# Altium schematic sheet RPM Inputs.SchDoc
size Letter; DocumentNumber: D_18; SheetNumber: 18; SheetTotal: 21
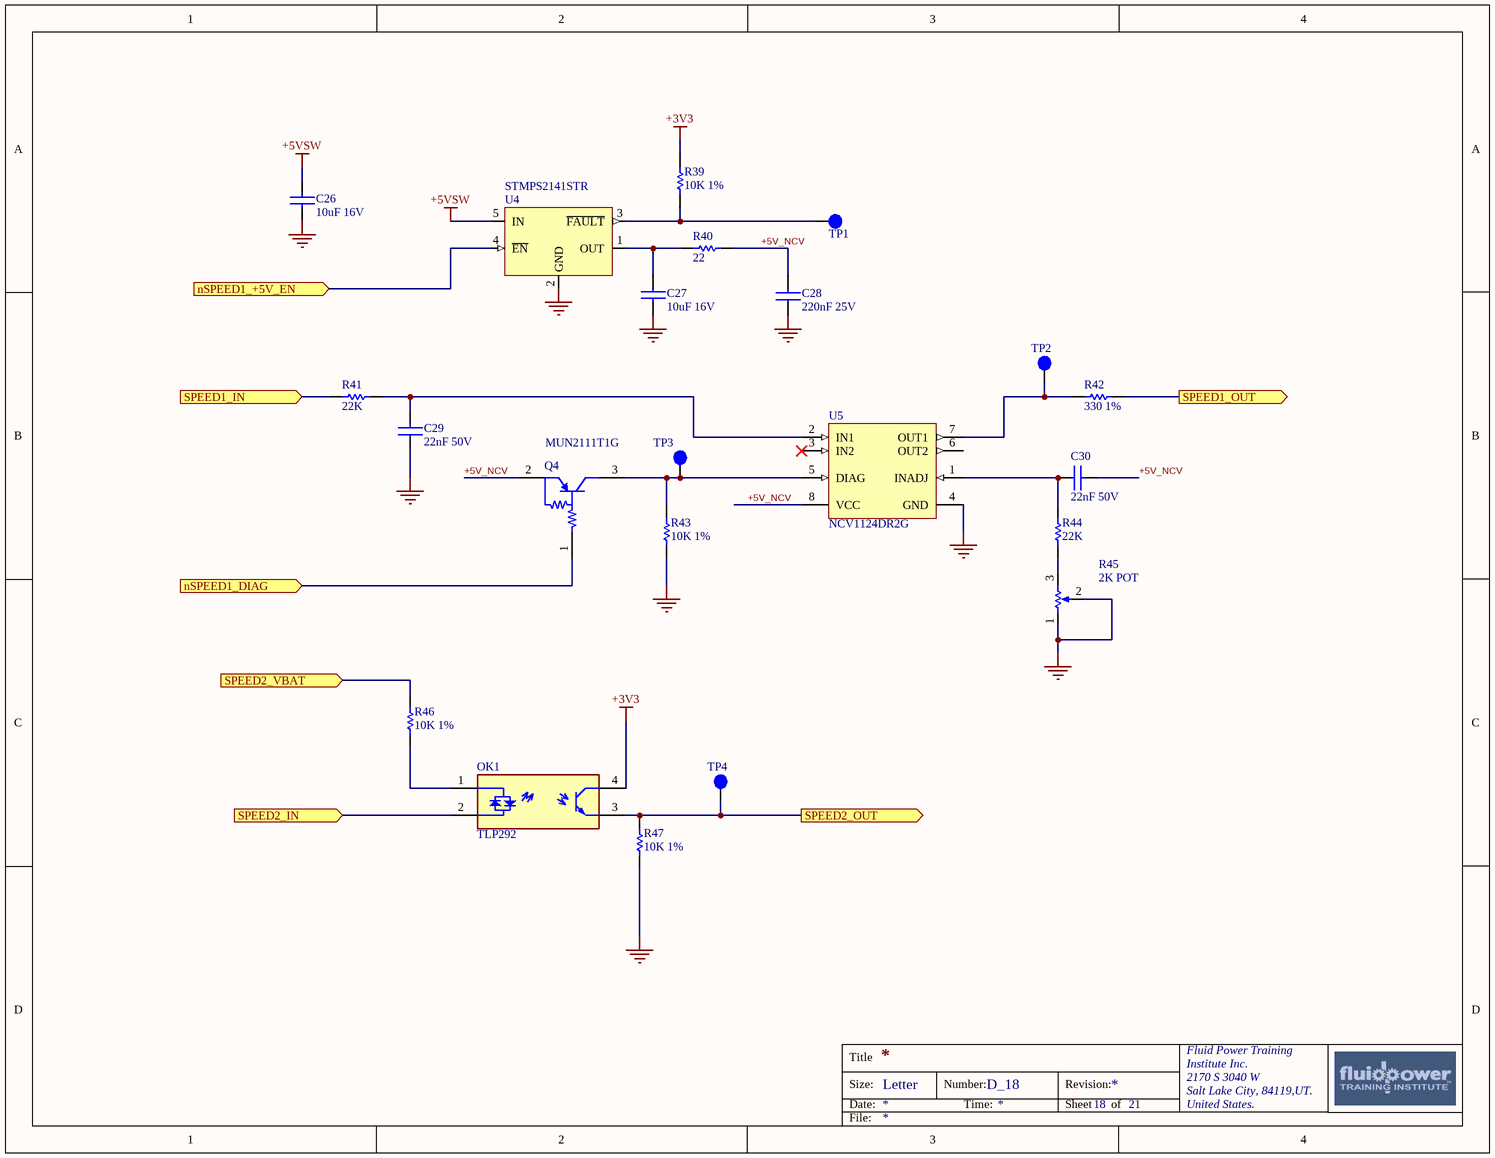
[diagram p0: RPM Inputs.SchDoc]

## Parts
C26  10uF 16V  [C0805]
C27  10uF 16V  [C0805]
C28  220nF 25V  [C0805]
C29  22nF 50V  [C0805]
C30  22nF 50V  [C0805]
OK1  TLP292  [SOIC127P700X220-4N]
Q4  MUN2111T1G  [ONSC-SC-59-3-318D-04_V]
R39  10K 1%  [R0805]
R40  22  [R0805]
R41  22K  [R0805]
R42  330 1%  [R0805]
R43  10K 1%  [R0805]
R44  22K  [R0805]
R45  2K POT  [TC33X]
R46  10K 1%  [R0805]
R47  10K 1%  [R0805]
TP1  T  [TESTPOINTSMD_1x1MM]  (value not drawn)  (no BOM)
TP2  T  [TESTPOINTSMD_1x1MM]  (value not drawn)  (no BOM)
TP3  T  [TESTPOINTSMD_1x1MM]  (value not drawn)  (no BOM)
TP4  T  [TESTPOINTSMD_1x1MM]  (value not drawn)  (no BOM)
U4  STMPS2141STR  [SOT95P280X145-5M]
U5  NCV1124DR2G  [ONSC-SOIC-8NB-8-751-07_V]

## Ports
nSPEED1_+5V_EN (in), nSPEED1_DIAG (in), SPEED1_IN (in), SPEED1_OUT (out), SPEED2_IN (in), SPEED2_OUT (out), SPEED2_VBAT (in)

## Nets
+3V3: OK1.4(COLLECTOR) R39.2
+5VSW: C26.1 U4.5(IN)
GND: C26.2 C27.2 C28.1 C29.1 R43.1 R45.1 R45.2 R47.1 U4.2(GND) U5.4(GND)
+5V_NCV: C28.2 C30.2 Q4.2(E) R40.2 U5.8(VCC)
nSPEED1_+5V_EN: U4.4(~{EN}) ; port nSPEED1_+5V_EN
nSPEED1_DIAG: Q4.1(B) ; port nSPEED1_DIAG
SPEED1_IN: R41.1 ; port SPEED1_IN
SPEED1_OUT: R42.2 ; port SPEED1_OUT
SPEED2_IN: OK1.2(A,C) ; port SPEED2_IN
SPEED2_OUT: OK1.3(EMITTER) R47.2 TP4.1 ; port SPEED2_OUT
SPEED2_VBAT: R46.2 ; port SPEED2_VBAT
NetC27_1: C27.1 R40.1 U4.1(OUT)
NetC29_2: C29.2 R41.2 U5.2(IN1)
NetC30_1: C30.1 R44.2 U5.1(INADJ)
NetOK1_1: OK1.1(C,A) R46.1
NetQ4_3: Q4.3(C) R43.2 TP3.1 U5.5(DIAG)
NetR39_1: R39.1 TP1.1 U4.3(~{FAULT})
NetR42_1: R42.1 TP2.1 U5.7(OUT1)
NetR44_1: R44.1 R45.3

Not connected (* = marked no-connect by the designer): U5 3(IN2)* 6(OUT2)

## Notes on the sheet
- Title
- Size:
- Date:
- Letter
- Number:
- Time:
- Revision:
- Sheet
- of
- Fluid Power Training
- Institute Inc.
- 2170 S 3040 W
- Salt Lake City, 84119,UT.
- United States.
- File:

## Library data of the parts
C26 C27 = GRM21BR61C106KE15L: CAP CER 10UF 16V X5R 0805; Manufacturer: Murata; Material: Ceramic; Tolerance: 10%; Supplier 1: Mouser; Supplier Part Number 1: 81-GRM21BR61C106KE15; Manufacturer Part Number: GRM21BR61C106KE15L; RoHS: Yes; Category: Ceramic Capacitors; Stock 1: 796080; Pricing 1: 1=0.31000, 10=0.21500, 100=0.12000, 500=0.08600, 1000=0.07500, 3000=0.06200 (USD); Mount: Surface Mount; Case/Package: 0805; Case Code (Imperial): 0805; Case Code (Metric): 2012; Min Operating Temperature: -55°C; Max Operating Temperature: 85°C; Packaging: Tape and Reel; Capacitance: 10uF; Voltage Rating: 16V; Package Quantity: 1; Voltage Rating (DC): 16V; Termination: SMD/SMT; Voltage: 16V; Dielectric: X5R; Length: 2mm; Height: 1.25mm; Width: 1.25mm; Depth: 1.25mm; Thickness: 0.053inch; Radiation Hardening: No; REACH SVHC: No SVHC; Lead Free: Lead Free; ComponentLink1URL: https://datasheet.ciiva.com/2989/product-2989696.pdf?src-supplier=Avnet; ComponentLink1Description: https://datasheet.ciiva.com/2989/product-2989696.pdf?src-supplier=Avnet; ComponentLink2URL: https://datasheet.ciiva.com/3777/1956grm21br61c106ke1523-3777137.pdf?src-supplier=Arrow; ComponentLink2Description: https://datasheet.ciiva.com/3777/1956grm21br61c106ke1523-3777137.pdf?src-supplier=Arrow; ComponentLink3URL: https://datasheet.ciiva.com/7719/1747468-7719090.pdf?src-supplier=Element14; ComponentLink3Description: https://datasheet.ciiva.com/7719/1747468-7719090.pdf?src-supplier=Element14; ComponentLink4URL: https://datasheet.ciiva.com/23628/460993-23628598.pdf?src-supplier=Newark; ComponentLink4Description: https://datasheet.ciiva.com/23628/460993-23628598.pdf?src-supplier=Newark; ComponentLink5URL: https://datasheet.ciiva.com/29202/450891-da-01-de-vs-chip-kond-0805-10-0-uf-10pr-16-0v-x5r-29202696.pdf?src-supplier=Conrad; ComponentLink5Description: https://datasheet.ciiva.com/29202/450891-da-01-de-vs-chip-kond-0805-10-0-uf-10pr-16-0v-x5r-29202696.pdf?src-supplier=Conrad; ComponentLink6URL: https://datasheet.ciiva.com/29199/454607-da-01-en-vs-kondensator-0805-29199611.pdf?src-supplier=Conrad; ComponentLink6Description: https://datasheet.ciiva.com/29199/454607-da-01-en-vs-kondensator-0805-29199611.pdf?src-supplier=Conrad; ComponentLink7URL: https://datasheet.ciiva.com/2989/product-2989697.pdf?src-supplier=Avnet; ComponentLink7Description: https://datasheet.ciiva.com/2989/product-2989697.pdf?src-supplier=Avnet; ComponentLink8URL: https://datasheet.ciiva.com/137/partnumbering-e-01-137917.pdf?src-supplier=Digi-Key; ComponentLink8Description: https://datasheet.ciiva.com/137/partnumbering-e-01-137917.pdf?src-supplier=Digi-Key; ComponentLink9URL: https://datasheet.ciiva.com/137/partnumbering-e-01-137918.pdf?src-supplier=Digi-Key; ComponentLink9Description: https://datasheet.ciiva.com/137/partnumbering-e-01-137918.pdf?src-supplier=Digi-Key; ComponentLink10URL: https://datasheet.ciiva.com/137/partnumbering-e-01-137919.pdf?src-supplier=Digi-Key; ComponentLink10Description: https://datasheet.ciiva.com/137/partnumbering-e-01-137919.pdf?src-supplier=Digi-Key
C28 = 08053C224JAT2A: AVX - 08053C224JAT2A - SMD Multilayer Ceramic Capacitor, 0.22 UF, 5%, X7R, 25 V, 0805 [2012 Metric] RoHS Compliant: Yes; Manufacturer: Kyocera AVX; Supplier 1: Mouser; Supplier Part Number 1: 581-08053C224JAT2A; Manufacturer Part Number: 08053C224JAT2A; RoHS: Yes; Category: Ceramic Capacitors; Stock 1: 712; Pricing 1: 1=0.28000, 10=0.19000, 100=0.09600, 500=0.09400, 1000=0.09400, 2000=0.09400 (USD); Mount: Surface Mount,PCB; Case/Package: 0805; Number of Pins: 2; Case Code (Imperial): 0805; Case Code (Metric): 2012; Dielectric Material: Ceramic; Contact Plating: Tin,Matte; Min Operating Temperature: -55°C; Max Operating Temperature: 125°C; Capacitance: 220nF; Tolerance: 5%; Packaging: Tape and Reel; Dielectric: X7R; Voltage Rating: 25V; Voltage Rating (DC): 25V; Termination: SMD/SMT; Package Quantity: 1; Voltage: 25V; Length: 2.01mm; Height: 1.4mm; Width: 1.25mm; Depth: 1.25mm; Thickness: 0.055inch; Radiation Hardening: No; REACH SVHC: No SVHC; Lead Free: Lead Free; ComponentLink1URL: https://datasheet.ciiva.com/5417/cx7r-218113-5417493.pdf?src-supplier=Mouser; ComponentLink1Description: https://datasheet.ciiva.com/5417/cx7r-218113-5417493.pdf?src-supplier=Mouser; ComponentLink2URL: https://datasheet.ciiva.com/16326/cx7r-16326599.pdf?src-supplier=Future+Electronics; ComponentLink2Description: https://datasheet.ciiva.com/16326/cx7r-16326599.pdf?src-supplier=Future+Electronics; ComponentLink3URL: https://datasheet.ciiva.com/162/cx7r-162344.pdf?src-supplier=Digi-Key; ComponentLink3Description: https://datasheet.ciiva.com/162/cx7r-162344.pdf?src-supplier=Digi-Key; ComponentLink4URL: https://datasheet.ciiva.com/162/cx7r-162345.pdf?src-supplier=Digi-Key; ComponentLink4Description: https://datasheet.ciiva.com/162/cx7r-162345.pdf?src-supplier=Digi-Key; ComponentLink5URL: https://datasheet.ciiva.com/162/cx7r-162346.pdf?src-supplier=Digi-Key; ComponentLink5Description: https://datasheet.ciiva.com/162/cx7r-162346.pdf?src-supplier=Digi-Key; ComponentLink6URL: https://datasheet.ciiva.com/17494/cx7r-17494874.pdf?src-supplier=Avnet+Europe; ComponentLink6Description: https://datasheet.ciiva.com/17494/cx7r-17494874.pdf?src-supplier=Avnet+Europe; ComponentLink7URL: https://datasheet.ciiva.com/14594/70001075-14594669.pdf?src-supplier=Allied+Electronics; ComponentLink7Description: https://datasheet.ciiva.com/14594/70001075-14594669.pdf?src-supplier=Allied+Electronics; ComponentLink8URL: https://datasheet.ciiva.com/7811/cx7r-7811999.pdf?src-supplier=Element14; ComponentLink8Description: https://datasheet.ciiva.com/7811/cx7r-7811999.pdf?src-supplier=Element14
C29 C30 = C0805C223K5RAC: KEMET 22nF Multilayer Ceramic Capacitor (MLCC) 50V dc 10% X7R dielectric max op. temp. 125C; Dissipation Factor: 2.5%; Supplier 1: Mouser; Supplier Part Number 1: 80-C0805C223K5RAC; Manufacturer: KEMET; Manufacturer Part Number: C0805C223K5RAC; RoHS: Yes; Category: Ceramic Capacitors; Stock 1: 100569; Pricing 1: 1=0.10000, 10=0.04800, 100=0.02400, 500=0.01900, 1000=0.01500, 4000=0.01000 (USD); Mount: Surface Mount; Case/Package: 0805; Dielectric Material: Ceramic; Case Code (Imperial): 0805; Case Code (Metric): 2012; Min Operating Temperature: -55°C; Max Operating Temperature: 125°C; Tolerance: 10%; Capacitance: 22nF; Dielectric: X7R; Packaging: Tape and Reel; Voltage Rating (DC): 50V; Termination: SMD/SMT; Package Quantity: 4000; Voltage Rating: 50V; Voltage: 50V; Length: 2mm; Height: 0.78mm; Depth: 1.25mm; Width: 1.2mm; Lead Pitch: 0.75mm; ComponentLink1URL: https://datasheet.ciiva.com/13384/kem-c1002-x7r-smd-357932-13384791.pdf?src-supplier=Mouser; ComponentLink1Description: https://datasheet.ciiva.com/13384/kem-c1002-x7r-smd-357932-13384791.pdf?src-supplier=Mouser; ComponentLink2URL: https://datasheet.ciiva.com/14116/slceramic-chip-condensers-e-14116587.pdf?src-supplier=Distrelec; ComponentLink2Description: https://datasheet.ciiva.com/14116/slceramic-chip-condensers-e-14116587.pdf?src-supplier=Distrelec
OK1 = TLP292(GB-TPL,E: OPTOISOLATOR 3.75KV TRANS 4-SO; Manufacturer: Toshiba; Collector Emitter Voltage (VCEO): 300mV; Number of Channels: 1; Forward Voltage: 1.25V; Max Output Voltage: 80V; Output Current per Channel: 50mA; Max Power Dissipation: 200mW; Supplier 1: Mouser; RoHS: Yes; Category: Optocouplers; Stock 1: 22194; Pricing 1: 1=0.60000, 10=0.35200, 100=0.23800, 500=0.20300, 1000=0.15900, 2500=0.13200, 10000=0.12400, 25000=0.11900, 50000=0.11500 (USD); Mount: Surface Mount; Case/Package: SO; Number of Pins: 4; Min Operating Temperature: -55°C; Max Operating Temperature: 125°C; Packaging: Tape and Reel; Max Input Current: 50mA; Max Collector Current: 50mA; Collector Emitter Saturation Voltage: 300mV; Package Quantity: 1; Radiation Hardening: No; ComponentLink1URL: https://datasheet.ciiva.com/29870/tlp292-datasheet-en-20130912-29870232.pdf?src-supplier=Digi-Key; ComponentLink1Description: https://datasheet.ciiva.com/29870/tlp292-datasheet-en-20130912-29870232.pdf?src-supplier=Digi-Key; ComponentLink2URL: https://datasheet.ciiva.com/29870/tlp292-datasheet-en-20130912-29870233.pdf?src-supplier=Digi-Key; ComponentLink2Description: https://datasheet.ciiva.com/29870/tlp292-datasheet-en-20130912-29870233.pdf?src-supplier=Digi-Key; ComponentLink3URL: https://datasheet.ciiva.com/29870/tlp292-datasheet-en-20130912-29870234.pdf?src-supplier=Digi-Key; ComponentLink3Description: https://datasheet.ciiva.com/29870/tlp292-datasheet-en-20130912-29870234.pdf?src-supplier=Digi-Key; ComponentLink4URL: https://datasheet.ciiva.com/30032/tlp292-datasheet-en-20130912-30032700.pdf?src-supplier=Avnet; ComponentLink4Description: https://datasheet.ciiva.com/30032/tlp292-datasheet-en-20130912-30032700.pdf?src-supplier=Avnet; Supplier Part Number 1: 757-TLP292GB-TPLE; Manufacturer Part Number: TLP292(GB-TPL,E
Q4 = MUN2111T1G: TRANS PREBIAS PNP 230MW SC59; Manufacturer: ON Semiconductor; Collector Emitter Voltage (VCEO): 50V; hFE Min: 35; Max Collector Current: 100mA; Element Configuration: Single; Voltage Rating (DC): -50V; Current Rating: -100mA; Collector Emitter Saturation Voltage: 250mV; Supplier 1: Mouser; Supplier Part Number 1: 863-MUN2111T1G; Manufacturer Part Number: MUN2111T1G; RoHS: Yes; Category: BJTs; Stock 1: 22623; Pricing 1: 1=0.14000, 10=0.12300, 100=0.04200, 1000=0.02900, 3000=0.02300, 9000=0.01900, 24000=0.01800, 45000=0.01500, 99000=0.01400 (USD); Case/Package: SC; Number of Pins: 3; Weight: 0.000282oz; Contact Plating: Tin,Matte; Min Operating Temperature: -55°C; Max Operating Temperature: 150°C; Packaging: Tape and Reel; Polarity: PNP; Package Quantity: 1; Max Power Dissipation: 230mW; Collector Emitter Breakdown Voltage: 50V; Continuous Collector Current: 100mA; Max Output Current: 100mA; Operating Supply Voltage: 50V; Max Breakdown Voltage: 50V; Length: 2.9mm; Height: 1.09mm; Width: 1.5mm; Radiation Hardening: No; Lead Free: Lead Free; Halogen Free: Halogen Free; REACH SVHC: No SVHC; ComponentLink1URL: https://datasheet.ciiva.com/989/dta114e-d-989072.pdf?src-supplier=Digi-Key; ComponentLink1Description: https://datasheet.ciiva.com/989/dta114e-d-989072.pdf?src-supplier=Digi-Key; ComponentLink2URL: https://datasheet.ciiva.com/15139/getdatasheetpartid-93629-15139627.pdf?src-supplier=Verical; ComponentLink2Description: https://datasheet.ciiva.com/15139/getdatasheetpartid-93629-15139627.pdf?src-supplier=Verical; ComponentLink3URL: https://datasheet.ciiva.com/989/dta114e-d-989073.pdf?src-supplier=Digi-Key; ComponentLink3Description: https://datasheet.ciiva.com/989/dta114e-d-989073.pdf?src-supplier=Digi-Key; ComponentLink4URL: https://datasheet.ciiva.com/989/dta114e-d-989074.pdf?src-supplier=Digi-Key; ComponentLink4Description: https://datasheet.ciiva.com/989/dta114e-d-989074.pdf?src-supplier=Digi-Key; ComponentLink5URL: https://datasheet.ciiva.com/16388/dta114e-d-16388471.pdf?src-supplier=Future+Electronics; ComponentLink5Description: https://datasheet.ciiva.com/16388/dta114e-d-16388471.pdf?src-supplier=Future+Electronics
R39 R43 R46 R47 = CRCW080510K0FKEA: VISHAY - CRCW080510K0FKEA - SMD Chip Resistor, 0805 [2012 Metric], 10 kohm, CRCW e3 Series, 150 V, Thick Film, 125 mW; Resistance: 10kR; Temperature Coefficient: 100ppm/°C; Power Rating: 125mW; Voltage Rating: 150V; Supplier 1: Mouser; Supplier Part Number 1: 71-CRCW0805-10K-E3; Manufacturer: Vishay; Manufacturer Part Number: CRCW080510K0FKEA; RoHS: Yes; Category: Chip SMD Resistors; Stock 1: 1138857; Pricing 1: 1=0.10000, 10=0.06200, 100=0.02500, 1000=0.01000, 5000=0.00700, 10000=0.00600 (USD); Case/Package: 0805; Weight: 0.000194oz; Case Code (Imperial): 0805; Case Code (Metric): 2012; Contact Plating: Tin; Min Operating Temperature: -55°C; Max Operating Temperature: 155°C; Tolerance: 1%; Packaging: Tape and Reel; Composition: Thick Film; Termination: SMD/SMT; Voltage Rating (DC): 150V; Package Quantity: 5000; Military Standard: Not; Length: 2mm; Height: 0.45mm; Width: 1.25mm; Depth: 1.25mm; Radiation Hardening: No; Lead Free: Lead Free; REACH SVHC: Unknown; ComponentLink1URL: https://datasheet.ciiva.com/11808/0900766b80d98b26-11808216.pdf?src-supplier=RSComponents; ComponentLink1Description: https://datasheet.ciiva.com/11808/0900766b80d98b26-11808216.pdf?src-supplier=RSComponents; ComponentLink2URL: https://datasheet.ciiva.com/5547/dcrcwe3-109170-5547559.pdf?src-supplier=Mouser; ComponentLink2Description: https://datasheet.ciiva.com/5547/dcrcwe3-109170-5547559.pdf?src-supplier=Mouser; ComponentLink3URL: https://datasheet.ciiva.com/16719/70201119-16719082.pdf?src-supplier=Allied+Electronics; ComponentLink3Description: https://datasheet.ciiva.com/16719/70201119-16719082.pdf?src-supplier=Allied+Electronics; ComponentLink4URL: https://datasheet.ciiva.com/16883/dcrcwe3-16883708.pdf?src-supplier=Avnet+Europe; ComponentLink4Description: https://datasheet.ciiva.com/16883/dcrcwe3-16883708.pdf?src-supplier=Avnet+Europe; ComponentLink5URL: https://datasheet.ciiva.com/8337/dcrcwe3-8337773.pdf?src-supplier=Avnet; ComponentLink5Description: https://datasheet.ciiva.com/8337/dcrcwe3-8337773.pdf?src-supplier=Avnet; ComponentLink6URL: https://datasheet.ciiva.com/46394/1720486-46394381.pdf?src-supplier=Element14; ComponentLink6Description: https://datasheet.ciiva.com/46394/1720486-46394381.pdf?src-supplier=Element14; ComponentLink7URL: https://datasheet.ciiva.com/16199/dcrcwe3-16199086.pdf?src-supplier=Future+Electronics; ComponentLink7Description: https://datasheet.ciiva.com/16199/dcrcwe3-16199086.pdf?src-supplier=Future+Electronics; ComponentLink8URL: https://datasheet.ciiva.com/16514/dcrcwe3-16514907.pdf?src-supplier=Avnet+Asia; ComponentLink8Description: https://datasheet.ciiva.com/16514/dcrcwe3-16514907.pdf?src-supplier=Avnet+Asia; ComponentLink9URL: https://datasheet.ciiva.com/16755/70201119-16755389.pdf?src-supplier=Allied+Electronics; ComponentLink9Description: https://datasheet.ciiva.com/16755/70201119-16755389.pdf?src-supplier=Allied+Electronics; ComponentLink10URL: https://datasheet.ciiva.com/8337/dcrcwe3-8337774.pdf?src-supplier=Avnet; ComponentLink10Description: https://datasheet.ciiva.com/8337/dcrcwe3-8337774.pdf?src-supplier=Avnet
R40 = CRCW080522R0JNEA: Resistor;  Thick Film;  22 Ohms;  0.125 W;  5%;  SMT;  0805;  TCR 73 ppm/DegC;  Cut Tape; Manufacturer: Vishay Dale; Resistance: 22R; Temperature Coefficient: 200ppm/°C; Power Rating: 125mW; Voltage Rating: 150V; Supplier 1: Mouser; Supplier Part Number 1: 71-CRCW080522R0JNEA; Manufacturer Part Number: CRCW080522R0JNEA; RoHS: Yes; Category: Chip SMD Resistors; Stock 1: 32788; Pricing 1: 1=0.10000, 10=0.03900, 100=0.01500, 1000=0.00600, 5000=0.00400, 10000=0.00400 (USD); Case/Package: 0805; Weight: 0.000194oz; Case Code (Imperial): 0805; Case Code (Metric): 2012; Contact Plating: Tin; Min Operating Temperature: -55°C; Max Operating Temperature: 155°C; Tolerance: 5%; Packaging: Tape and Reel; Composition: Thick Film; Number of Terminations: 2; Max Power Dissipation: 125mW; Termination: Solder; Package Quantity: 5000; Voltage Rating (DC): 150V; Features: Automotive AEC-Q200; Military Standard: Not; Length: 2mm; Height: 0.02inch; Width: 1.25mm; Depth: 1.25mm; Radiation Hardening: No; Lead Free: Lead Free; REACH SVHC: Unknown; ComponentLink1URL: https://datasheet.ciiva.com/28606/1847332-28606766.pdf?src-supplier=Element14; ComponentLink1Description: https://datasheet.ciiva.com/28606/1847332-28606766.pdf?src-supplier=Element14; ComponentLink2URL: https://datasheet.ciiva.com/22871/70201119-22871903.pdf?src-supplier=Allied+Electronics; ComponentLink2Description: https://datasheet.ciiva.com/22871/70201119-22871903.pdf?src-supplier=Allied+Electronics; ComponentLink3URL: https://datasheet.ciiva.com/2464/dcrcwe3-2464258.pdf?src-supplier=Digi-Key; ComponentLink3Description: https://datasheet.ciiva.com/2464/dcrcwe3-2464258.pdf?src-supplier=Digi-Key; ComponentLink4URL: https://datasheet.ciiva.com/16358/dcrcwe3-16358364.pdf?src-supplier=Future+Electronics; ComponentLink4Description: https://datasheet.ciiva.com/16358/dcrcwe3-16358364.pdf?src-supplier=Future+Electronics; ComponentLink5URL: https://datasheet.ciiva.com/16769/70201119-16769711.pdf?src-supplier=Allied+Electronics; ComponentLink5Description: https://datasheet.ciiva.com/16769/70201119-16769711.pdf?src-supplier=Allied+Electronics
R41 R44 = ERJ6ENF2202V: PANASONIC - ERJ6ENF2202V - SMD Chip Resistor, 0805 [2012 Metric], 22 kohm, ERJ6EN Series, 150 V, Thick Film, 125 mW; Resistance: 22kR; Tolerance: 1%; Temperature Coefficient: 100ppm/°C; Power Rating: 125mW; Voltage Rating: 150V; Supplier 1: Mouser; Supplier Part Number 1: 667-ERJ-6ENF2202V; Manufacturer: Panasonic; Manufacturer Part Number: ERJ6ENF2202V; RoHS: Yes; Category: Chip SMD Resistors; Stock 1: 57430; Pricing 1: 1=0.10000, 10=0.08300, 100=0.03200, 1000=0.01800, 5000=0.01800, 10000=0.01800 (USD); Mount: Surface Mount; Case/Package: 0805; Number of Pins: 2; Case Code (Imperial): 0805; Case Code (Metric): 2012; Contact Plating: Tin; Min Operating Temperature: -55°C; Max Operating Temperature: 155°C; Packaging: Tape and Reel; Composition: Thick Film; Number of Terminations: 2; Max Power Dissipation: 125mW; Termination: SMD/SMT; Package Quantity: 1; Voltage Rating (DC): 150V; Features: Automotive AEC-Q200; Military Standard: Not; Length: 2mm; Height: 0.6mm; Width: 1.2mm; Depth: 1.25mm; Radiation Hardening: No; Lead Free: Lead Free; REACH SVHC: No SVHC; ComponentLink1URL: https://datasheet.ciiva.com/11821/0900766b80f80784-11821559.pdf?src-supplier=RSComponents; ComponentLink1Description: https://datasheet.ciiva.com/11821/0900766b80f80784-11821559.pdf?src-supplier=RSComponents; ComponentLink2URL: https://datasheet.ciiva.com/24070/aoa0000ce2-24070245.pdf?src-supplier=Mouser; ComponentLink2Description: https://datasheet.ciiva.com/24070/aoa0000ce2-24070245.pdf?src-supplier=Mouser; ComponentLink3URL: https://datasheet.ciiva.com/30139/aoa0000ce2-30139797.pdf?src-supplier=Onlinecomponents.com; ComponentLink3Description: https://datasheet.ciiva.com/30139/aoa0000ce2-30139797.pdf?src-supplier=Onlinecomponents.com; ComponentLink4URL: https://datasheet.ciiva.com/7802/426256-7802439.pdf?src-supplier=Element14; ComponentLink4Description: https://datasheet.ciiva.com/7802/426256-7802439.pdf?src-supplier=Element14; ComponentLink5URL: https://datasheet.ciiva.com/22687/1678782-22687079.pdf?src-supplier=Element14; ComponentLink5Description: https://datasheet.ciiva.com/22687/1678782-22687079.pdf?src-supplier=Element14; ComponentLink6URL: https://datasheet.ciiva.com/16787/70260748-16787961.pdf?src-supplier=Allied+Electronics; ComponentLink6Description: https://datasheet.ciiva.com/16787/70260748-16787961.pdf?src-supplier=Allied+Electronics; ComponentLink7URL: https://datasheet.ciiva.com/17210/aoa0000ce2-17210956.pdf?src-supplier=Avnet+Europe; ComponentLink7Description: https://datasheet.ciiva.com/17210/aoa0000ce2-17210956.pdf?src-supplier=Avnet+Europe; ComponentLink8URL: https://datasheet.ciiva.com/22668/1678782-22668332.pdf?src-supplier=Element14; ComponentLink8Description: https://datasheet.ciiva.com/22668/1678782-22668332.pdf?src-supplier=Element14; ComponentLink9URL: https://datasheet.ciiva.com/6138/426256-6138190.pdf?src-supplier=Farnell; ComponentLink9Description: https://datasheet.ciiva.com/6138/426256-6138190.pdf?src-supplier=Farnell; ComponentLink10URL: https://datasheet.ciiva.com/46419/1678782-46419998.pdf?src-supplier=Element14; ComponentLink10Description: https://datasheet.ciiva.com/46419/1678782-46419998.pdf?src-supplier=Element14
R42 = ERJ-6ENF3300V: RES SMD 330 OHM 1% 1/8W 0805; Manufacturer: Panasonic; Resistance: 330R; Power Rating: 125mW; Temperature Coefficient: 100ppm/°C; Voltage Rating: 150V; Supplier 1: Mouser; Supplier Part Number 1: 667-ERJ-6ENF3300V; Manufacturer Part Number: ERJ-6ENF3300V; RoHS: Yes; Category: Chip SMD Resistors; Stock 1: 121287; Pricing 1: 1=0.10000, 10=0.08900, 100=0.03500, 500=0.03500, 1000=0.01900, 5000=0.01700 (USD); Mount: Surface Mount; Case/Package: 0805; Number of Pins: 2; Case Code (Imperial): 0805; Case Code (Metric): 2012; Contact Plating: Tin; Min Operating Temperature: -55°C; Max Operating Temperature: 155°C; Packaging: Tape and Reel; Tolerance: 1%; Composition: Thick Film; Termination: SMD/SMT; Number of Terminations: 2; Max Power Dissipation: 125mW; Package Quantity: 1; Military Standard: Not; Features: Automotive AEC-Q200; Length: 2mm; Height: 0.6mm; Width: 1.2mm; Depth: 1.25mm; Radiation Hardening: No; REACH SVHC: No SVHC; ComponentLink1URL: https://datasheet.ciiva.com/11821/0900766b80f80784-11821635.pdf?src-supplier=RSComponents; ComponentLink1Description: https://datasheet.ciiva.com/11821/0900766b80f80784-11821635.pdf?src-supplier=RSComponents; ComponentLink2URL: https://datasheet.ciiva.com/30131/aoa0000ce2-30131349.pdf?src-supplier=Onlinecomponents.com; ComponentLink2Description: https://datasheet.ciiva.com/30131/aoa0000ce2-30131349.pdf?src-supplier=Onlinecomponents.com; ComponentLink3URL: https://datasheet.ciiva.com/24025/aoa0000ce2-24025991.pdf?src-supplier=Mouser; ComponentLink3Description: https://datasheet.ciiva.com/24025/aoa0000ce2-24025991.pdf?src-supplier=Mouser; ComponentLink4URL: https://datasheet.ciiva.com/17206/aoa0000ce2-17206152.pdf?src-supplier=Avnet+Europe; ComponentLink4Description: https://datasheet.ciiva.com/17206/aoa0000ce2-17206152.pdf?src-supplier=Avnet+Europe; ComponentLink5URL: https://datasheet.ciiva.com/46436/1678782-46436633.pdf?src-supplier=Element14; ComponentLink5Description: https://datasheet.ciiva.com/46436/1678782-46436633.pdf?src-supplier=Element14; ComponentLink6URL: https://datasheet.ciiva.com/46436/1678782-46436634.pdf?src-supplier=Element14; ComponentLink6Description: https://datasheet.ciiva.com/46436/1678782-46436634.pdf?src-supplier=Element14; ComponentLink7URL: https://datasheet.ciiva.com/16760/70260748-16760668.pdf?src-supplier=Allied+Electronics; ComponentLink7Description: https://datasheet.ciiva.com/16760/70260748-16760668.pdf?src-supplier=Allied+Electronics; ComponentLink8URL: https://datasheet.ciiva.com/16780/70260748-16780764.pdf?src-supplier=Allied+Electronics; ComponentLink8Description: https://datasheet.ciiva.com/16780/70260748-16780764.pdf?src-supplier=Allied+Electronics; ComponentLink9URL: https://datasheet.ciiva.com/22684/1678782-22684798.pdf?src-supplier=Element14; ComponentLink9Description: https://datasheet.ciiva.com/22684/1678782-22684798.pdf?src-supplier=Element14; ComponentLink10URL: https://datasheet.ciiva.com/28590/1678782-28590783.pdf?src-supplier=Element14; ComponentLink10Description: https://datasheet.ciiva.com/28590/1678782-28590783.pdf?src-supplier=Element14
R45 = TC33X-2-202E: GLOVE, POLYAMIDE, L/FREE, PU, SIZE 6 - More Details; Manufacturer: Bourns; Tolerance: 25%; Resistance: 2kR; Voltage Rating (DC): 50V; Temperature Coefficient: 250ppm/°C; Number of Turns: 1; Max Power Dissipation: 100mW; Supplier 1: Mouser; Supplier Part Number 1: 652-TC33X-2-202E; Manufacturer Part Number: TC33X-2-202E; RoHS: Yes; Category: Variable Resistors and Potentiometers; Stock 1: 7933; Pricing 1: 1=0.29000, 10=0.28600, 100=0.24000, 500=0.20500, 1000=0.18600, 2500=0.15500 (USD); Mount: Surface Mount; Weight: 29.4mg; Color: Silver; Min Operating Temperature: -40°C; Max Operating Temperature: 100°C; Composition: Carbon,Potentiometer,Cermet; Termination: Foot Print; Military Standard: Not; Packaging: Tape and Reel; Power Rating: 100mW; Package Quantity: 2500; Length: 3mm; Height: 0.047inch; Depth: 3.8mm; Width: 0.118inch; Radiation Hardening: No; Lead Free: Lead Free; REACH SVHC: No SVHC; ComponentLink1URL: https://datasheet.ciiva.com/11833/0900766b802749b3-11833210.pdf?src-supplier=RSComponents; ComponentLink1Description: https://datasheet.ciiva.com/11833/0900766b802749b3-11833210.pdf?src-supplier=RSComponents; ComponentLink2URL: https://datasheet.ciiva.com/2155/tc33-2155974.pdf?src-supplier=Digi-Key; ComponentLink2Description: https://datasheet.ciiva.com/2155/tc33-2155974.pdf?src-supplier=Digi-Key; ComponentLink3URL: https://datasheet.ciiva.com/2155/tc33-2155975.pdf?src-supplier=Digi-Key; ComponentLink3Description: https://datasheet.ciiva.com/2155/tc33-2155975.pdf?src-supplier=Digi-Key; ComponentLink4URL: https://datasheet.ciiva.com/22708/1818686-22708487.pdf?src-supplier=Element14; ComponentLink4Description: https://datasheet.ciiva.com/22708/1818686-22708487.pdf?src-supplier=Element14; ComponentLink5URL: https://datasheet.ciiva.com/2155/tc33-2155976.pdf?src-supplier=Digi-Key; ComponentLink5Description: https://datasheet.ciiva.com/2155/tc33-2155976.pdf?src-supplier=Digi-Key; ComponentLink6URL: https://datasheet.ciiva.com/17563/tc33-17563422.pdf?src-supplier=Avnet+Europe; ComponentLink6Description: https://datasheet.ciiva.com/17563/tc33-17563422.pdf?src-supplier=Avnet+Europe; ComponentLink7URL: https://datasheet.ciiva.com/7953/1818686-7953183.pdf?src-supplier=Element14; ComponentLink7Description: https://datasheet.ciiva.com/7953/1818686-7953183.pdf?src-supplier=Element14
TP1-TP4 = TestPoint_SMD_1x1: SMD Test Point
U4 = STMPS2141STR: IC PWR SWITCH 1CH 500MA SOT23-5; Manufacturer: STMicroelectronics; Nominal Supply Current: 40uA; Max Power Dissipation: 32.5mW; Number of Outputs: 1; Max Input Voltage: 5.5V; Min Input Voltage: 2.7V; Output Current: 0pA; On-State Resistance: 120mR; Turn-On Delay Time: 5ms; Turn-Off Delay Time: 10ms; Interface: On/Off; Fault Protection: Over Temperature,Reverse Current; Output Configuration: High Side; Supplier 1: Mouser; Supplier Part Number 1: 511-STMPS2141STR; Manufacturer Part Number: STMPS2141STR; RoHS: Yes; Category: Hot Swap Controllers; Stock 1: 7375; Pricing 1: 1=0.58000, 10=0.48800, 100=0.29800, 1000=0.23000, 3000=0.19600, 9000=0.18300 (USD); Mount: Surface Mount; Case/Package: SOT-23-5; Number of Pins: 5; Min Operating Temperature: -40°C; Max Operating Temperature: 85°C; Packaging: Tape and Reel; Package Quantity: 3000; Current Rating: 500mA; Max Supply Current: 40uA; Power Dissipation: 32.5mW; Operating Supply Voltage: 5.5V; Max Output Current: 500mA; Number of Inputs: 1; Voltage: 5.5V; Current: 500mA; Length: 3mm; Height: 1.3mm; Width: 1.75mm; Radiation Hardening: No; Lead Free: Lead Free; ComponentLink1URL: https://datasheet.ciiva.com/15108/getdatasheetpartid-160072-15108990.pdf?src-supplier=Verical; ComponentLink1Description: https://datasheet.ciiva.com/15108/getdatasheetpartid-160072-15108990.pdf?src-supplier=Verical; ComponentLink2URL: https://datasheet.ciiva.com/4923/cd00167470-4923447.pdf?src-supplier=Mouser; ComponentLink2Description: https://datasheet.ciiva.com/4923/cd00167470-4923447.pdf?src-supplier=Mouser; ComponentLink3URL: https://datasheet.ciiva.com/1962/cd00167470-1962472.pdf?src-supplier=Digi-Key; ComponentLink3Description: https://datasheet.ciiva.com/1962/cd00167470-1962472.pdf?src-supplier=Digi-Key; ComponentLink4URL: https://datasheet.ciiva.com/1962/cd00167470-1962473.pdf?src-supplier=Digi-Key; ComponentLink4Description: https://datasheet.ciiva.com/1962/cd00167470-1962473.pdf?src-supplier=Digi-Key; ComponentLink5URL: https://datasheet.ciiva.com/1962/cd00167470-1962474.pdf?src-supplier=Digi-Key; ComponentLink5Description: https://datasheet.ciiva.com/1962/cd00167470-1962474.pdf?src-supplier=Digi-Key; ComponentLink6URL: https://datasheet.ciiva.com/16491/cd00167470-16491245.pdf?src-supplier=Future+Electronics; ComponentLink6Description: https://datasheet.ciiva.com/16491/cd00167470-16491245.pdf?src-supplier=Future+Electronics
U5 = NCV1124DR2G: ON SEMICONDUCTOR - NCV1124DR2G - Variable Reluctance Sensor, 4.5 V-5.5 V supply, SOIC-8; Interface: Serial,Parallel; Min Supply Voltage: 4.5V; Max Supply Voltage: 5.5V; Operating Supply Voltage: 5V; Nominal Supply Current: 5mA; Output Current: 1.6mA; Output Voltage: 5.3V; Input Bias Current: 11uA; Supplier 1: Mouser; Supplier Part Number 1: 863-NCV1124DR2G; Manufacturer: ON Semiconductor; Manufacturer Part Number: NCV1124DR2G; RoHS: Yes; Category: Interface ICs; Stock 1: 2109; Pricing 1: 1=2.26000, 10=1.92000, 100=1.34000, 500=1.30000, 1000=1.06000, 2500=1.00000, 5000=0.96200, 25000=0.93300 (USD); Case/Package: SOIC; Number of Pins: 8; Contact Plating: Tin,Matte; Min Operating Temperature: -40°C; Max Operating Temperature: 125°C; Package Quantity: 1; Packaging: Tape and Reel; Operating Supply Current: 5mA; Radiation Hardening: No; REACH SVHC: No SVHC; Lead Free: Lead Free; Halogen Free: Halogen Free; ComponentLink1URL: https://datasheet.ciiva.com/4781/ncv112420data20sheet-113730-4781808.pdf?src-supplier=Mouser; ComponentLink1Description: https://datasheet.ciiva.com/4781/ncv112420data20sheet-113730-4781808.pdf?src-supplier=Mouser; ComponentLink2URL: https://datasheet.ciiva.com/15098/getdatasheetpartid-304827-15098896.pdf?src-supplier=Verical; ComponentLink2Description: https://datasheet.ciiva.com/15098/getdatasheetpartid-304827-15098896.pdf?src-supplier=Verical; ComponentLink3URL: https://datasheet.ciiva.com/3276/ncv112420data20sheet-3276691.pdf?src-supplier=Avnet; ComponentLink3Description: https://datasheet.ciiva.com/3276/ncv112420data20sheet-3276691.pdf?src-supplier=Avnet; ComponentLink4URL: https://datasheet.ciiva.com/6633/ncv1124-data-sheet-6633306.pdf?src-supplier=Digi-Key; ComponentLink4Description: https://datasheet.ciiva.com/6633/ncv1124-data-sheet-6633306.pdf?src-supplier=Digi-Key; ComponentLink5URL: https://datasheet.ciiva.com/6633/ncv1124-data-sheet-6633308.pdf?src-supplier=Digi-Key; ComponentLink5Description: https://datasheet.ciiva.com/6633/ncv1124-data-sheet-6633308.pdf?src-supplier=Digi-Key; ComponentLink6URL: https://datasheet.ciiva.com/16220/ncv1124datasheet-16220093.pdf?src-supplier=Future+Electronics; ComponentLink6Description: https://datasheet.ciiva.com/16220/ncv1124datasheet-16220093.pdf?src-supplier=Future+Electronics